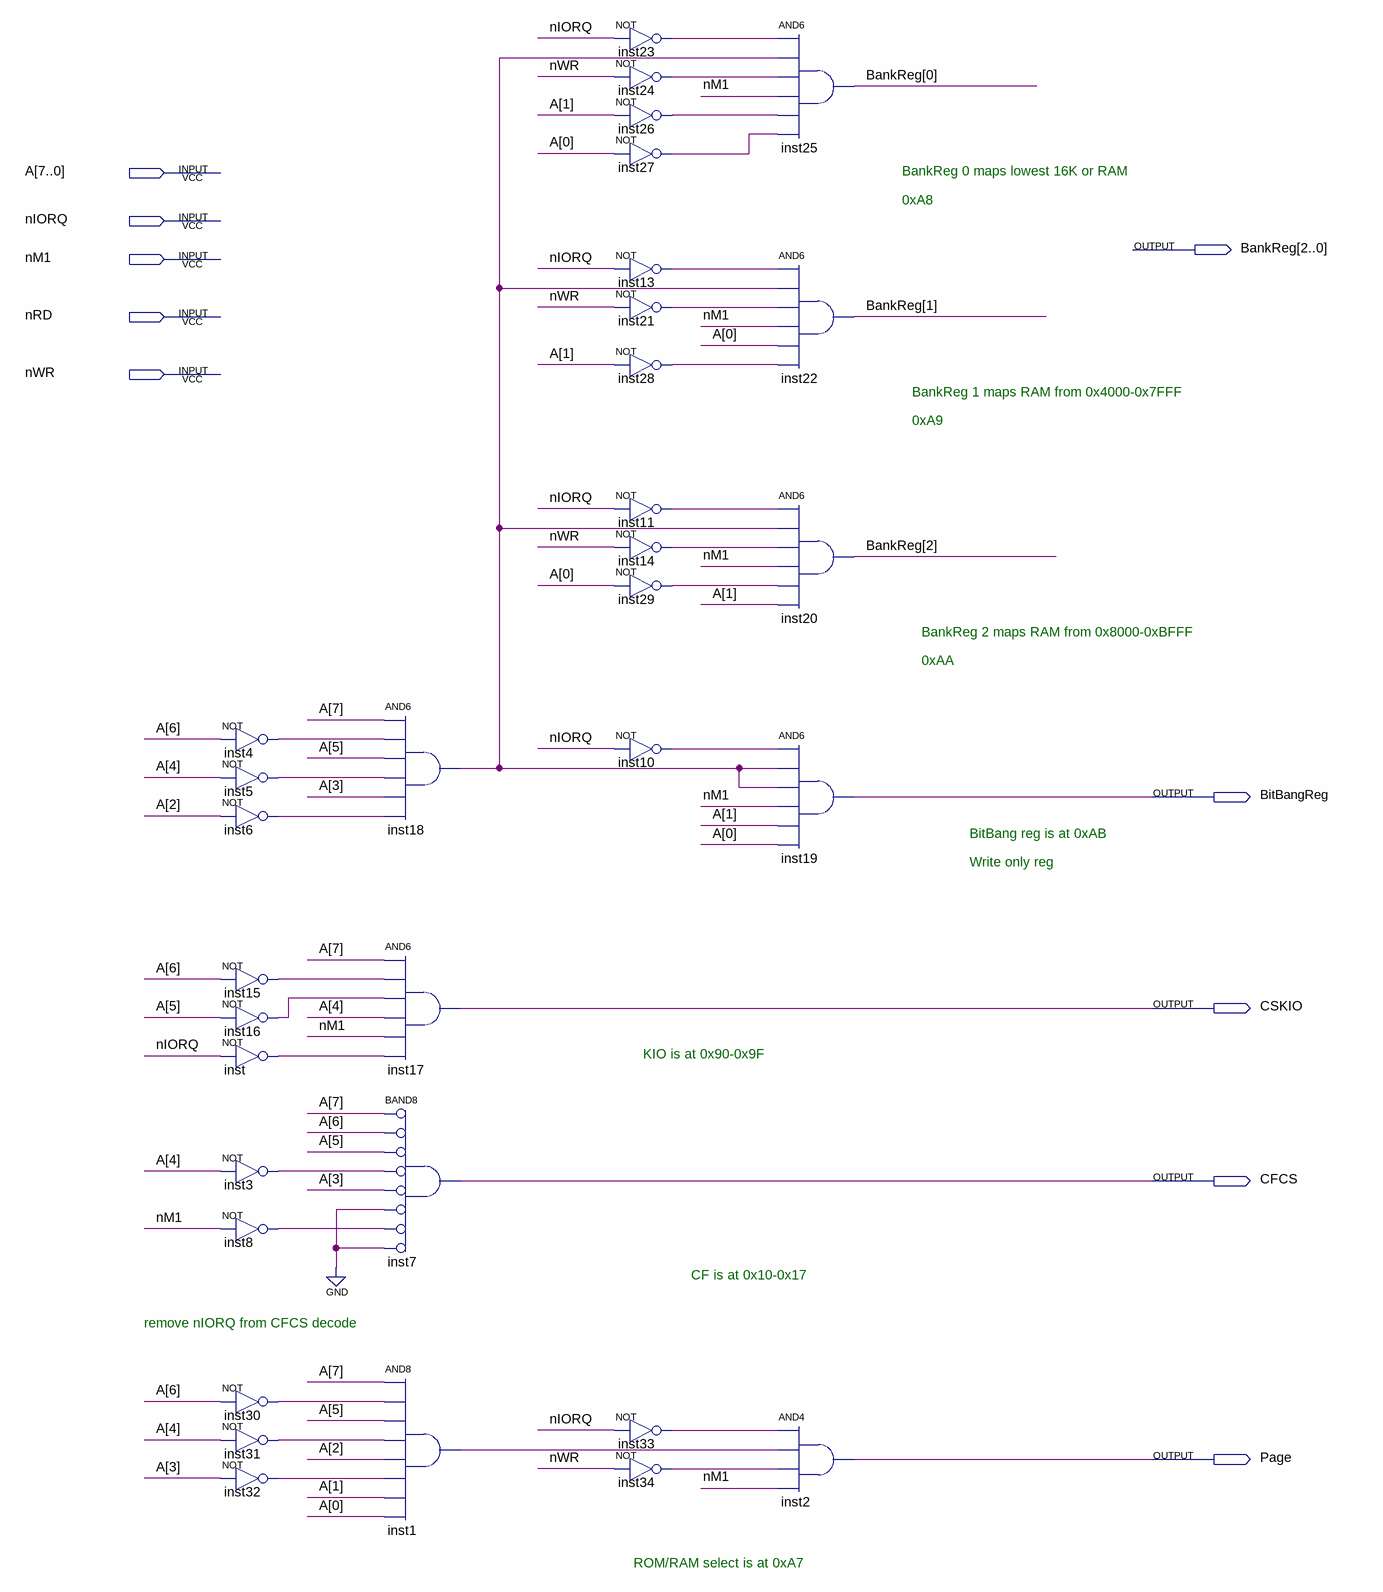
[diagram p0: schematic sheet]
// Quartus schematic IOMap.bdf as structural Verilog: 33 symbols, 10 pins
module IOMap (
  input  [7:0] A,
  input  nIORQ,
  input  nM1,
  input  nRD,
  input  nWR,
  output [2:0] BankReg,
  output BitBangReg,
  output CSKIO,
  output CFCS,
  output Page
);

  wire inst1_out, inst3_out, inst4_out, inst5_out, inst6_out, inst8_out, inst10_out, inst11_out, inst13_out,
       inst14_out, inst15_out, inst16_out, inst18_out, inst21_out, inst23_out, inst24_out, inst26_out,
       inst27_out, inst28_out, inst29_out, inst30_out, inst31_out, inst32_out, inst33_out, inst34_out,
       inst_out;

  not inst4 (inst4_out, A[6]);
  not inst5 (inst5_out, A[4]);
  not inst6 (inst6_out, A[2]);
  not inst15 (inst15_out, A[6]);
  not inst16 (inst16_out, A[5]);
  not inst (inst_out, nIORQ);
  not inst3 (inst3_out, A[4]);
  not inst8 (inst8_out, nM1);
  not inst30 (inst30_out, A[6]);
  not inst31 (inst31_out, A[4]);
  not inst32 (inst32_out, A[3]);
  and inst18 (inst18_out, A[7], inst4_out, A[5], inst5_out, A[3], inst6_out);
  and inst17 (CSKIO, A[7], inst15_out, inst16_out, A[4], nM1, inst_out);
  and inst7 (CFCS, ~A[7], ~A[6], ~A[5], ~inst3_out, ~A[3], ~1'b0, ~inst8_out, ~1'b0);  // BAND8
  and inst1 (inst1_out, A[7], inst30_out, A[5], inst31_out, A[2], inst32_out, A[1], A[0]);
  not inst23 (inst23_out, nIORQ);
  not inst24 (inst24_out, nWR);
  not inst26 (inst26_out, A[1]);
  not inst27 (inst27_out, A[0]);
  not inst13 (inst13_out, nIORQ);
  not inst21 (inst21_out, nWR);
  not inst28 (inst28_out, A[1]);
  not inst11 (inst11_out, nIORQ);
  not inst14 (inst14_out, nWR);
  not inst29 (inst29_out, A[0]);
  not inst10 (inst10_out, nIORQ);
  not inst33 (inst33_out, nIORQ);
  not inst34 (inst34_out, nWR);
  and inst25 (BankReg[0], inst23_out, inst18_out, inst24_out, nM1, inst26_out, inst27_out);
  and inst22 (BankReg[1], inst13_out, inst18_out, inst21_out, nM1, A[0], inst28_out);
  and inst20 (BankReg[2], inst11_out, inst18_out, inst14_out, nM1, inst29_out, A[1]);
  and inst19 (BitBangReg, inst10_out, inst18_out, inst18_out, nM1, A[1], A[0]);
  and inst2 (Page, inst33_out, inst1_out, inst34_out, nM1);

  // Notes on the sheet:
  //   BankReg 0 maps lowest 16K or RAM
  //   0xA8
  //   BankReg 1 maps RAM from 0x4000-0x7FFF
  //   0xA9
  //   BankReg 2 maps RAM from 0x8000-0xBFFF
  //   0xAA
  //   BitBang reg is at 0xAB
  //   Write only reg
  //   KIO is at 0x90-0x9F
  //   CF is at 0x10-0x17
  //   remove nIORQ from CFCS decode
  //   ROM/RAM select is at 0xA7
endmodule
